# EAGLE design bridgeScheme (EAGLE 8.0.2)
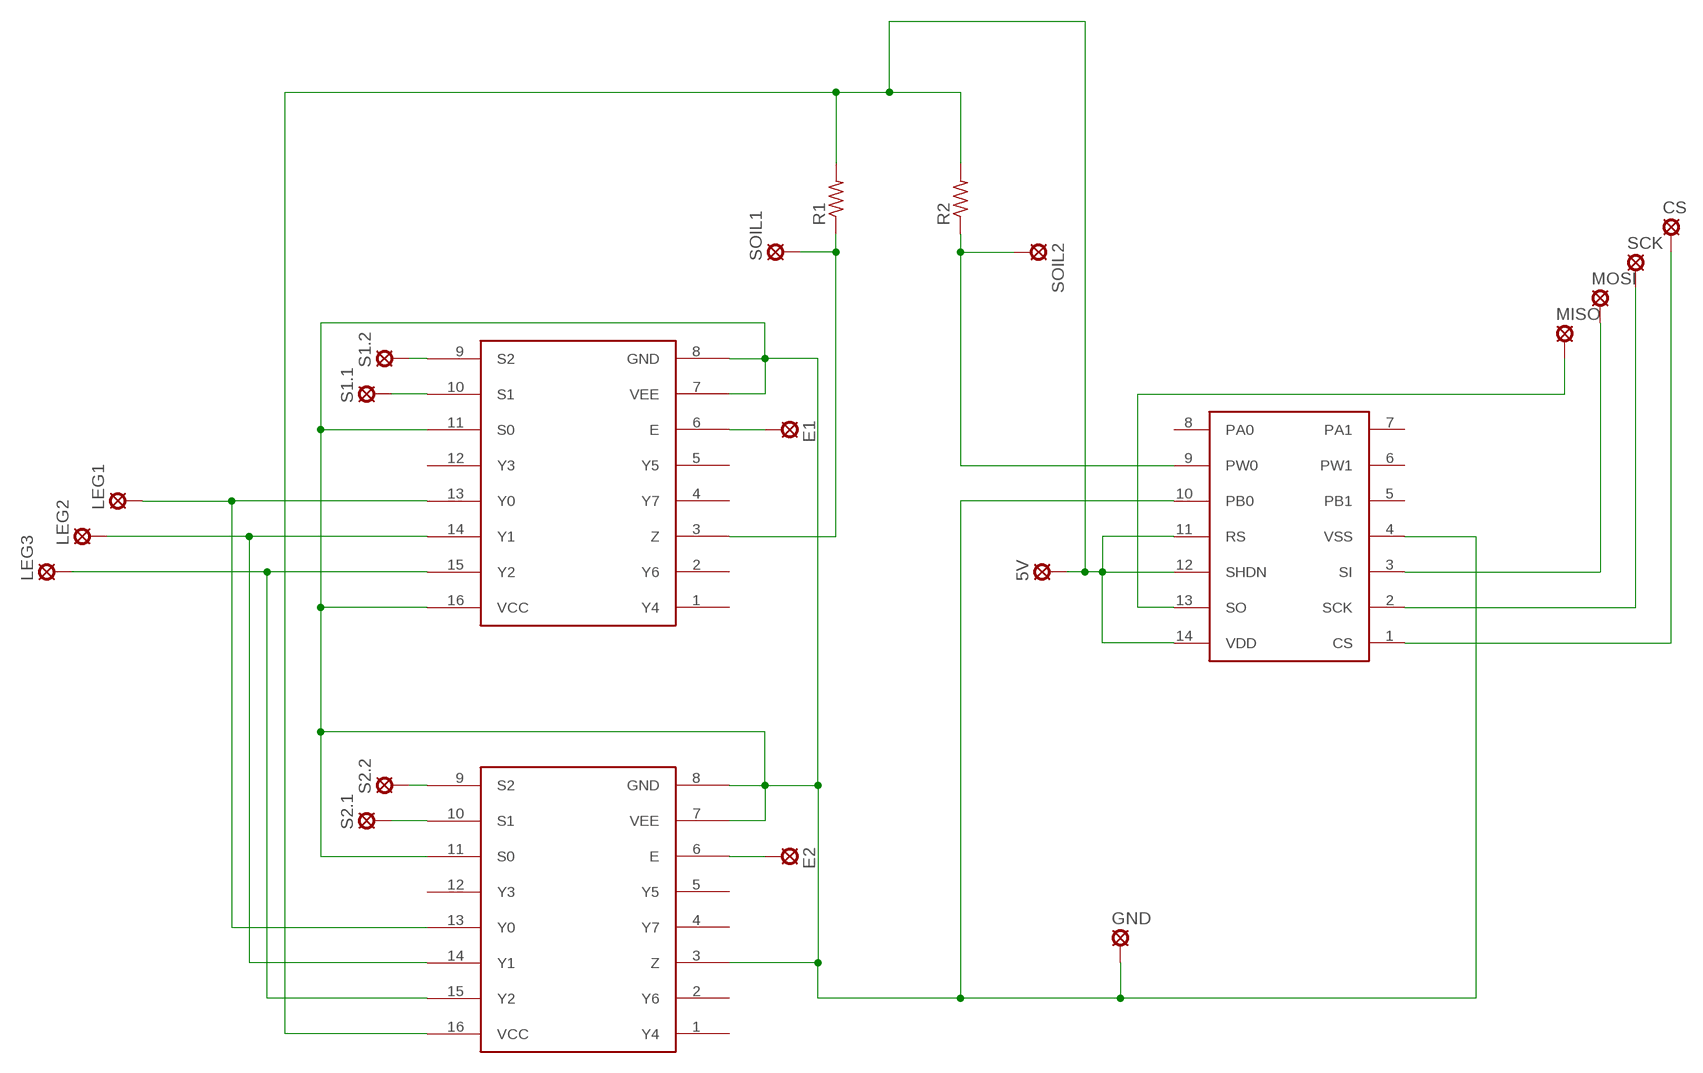
[diagram p0: schematic, sheet 1]

## Parts
5V  LSP10  [LSP10]
CS  LSP10  [LSP10]
E1  LSP10  [LSP10]
E2  LSP10  [LSP10]
GND  LSP10  [LSP10]
LEG1  LSP10  [LSP10]
LEG2  LSP10  [LSP10]
LEG3  LSP10  [LSP10]
MISO  LSP10  [LSP10]
MOSI  LSP10  [LSP10]
R1  R-US_0207/10  [0207/10]
R2  R-US_0207/10  [0207/10]
S1.1  LSP10  [LSP10]
S1.2  LSP10  [LSP10]
S2.1  LSP10  [LSP10]
S2.2  LSP10  [LSP10]
SCK  LSP10  [LSP10]
SOIL1  LSP10  [LSP10]
SOIL2  LSP10  [LSP10]
U$1  MCP42100!  [DIL14]
U$2  74HC4051!  [DIL16]
U$3  74HC4051!  [DIL16]

## Nets
5V: 5V.MP R1.2 R2.2 U$1.11(RS) U$1.12(SHDN) U$1.14(VDD) U$3.16(VCC)
CS: CS.MP U$1.1(CS)
E1: E1.MP U$2.6(E)
E2: E2.MP U$3.6(E)
GND: GND.MP U$1.4(VSS) U$1.10(PB0) U$2.7(VEE) U$2.8(GND) U$2.11(S0) U$2.16(VCC) U$3.3(Z) U$3.7(VEE) U$3.8(GND) U$3.11(S0)
MISO: MISO.MP U$1.13(SO)
MOSI: MOSI.MP U$1.3(SI)
S1.1: S1.1.MP U$2.10(S1)
S1.2: S1.2.MP U$2.9(S2)
S2.1: S2.1.MP U$3.10(S1)
S2.2: S2.2.MP U$3.9(S2)
SCK: SCK.MP U$1.2(SCK)
SOIL-1: R1.1 SOIL1.MP U$2.3(Z)
SOIL-2: R2.1 SOIL2.MP U$1.9(PW0)
Y0: LEG1.MP U$2.13(Y0) U$3.13(Y0)
Y1: LEG2.MP U$2.14(Y1) U$3.14(Y1)
Y2: LEG3.MP U$2.15(Y2) U$3.15(Y2)
Unconnected: U$1.5(PB1) U$1.6(PW1) U$1.7(PA1) U$1.8(PA0) U$2.1(Y4) U$2.2(Y6) U$2.4(Y7) U$2.5(Y5) U$2.12(Y3) U$3.1(Y4) U$3.2(Y6) U$3.4(Y7) U$3.5(Y5) U$3.12(Y3)

## Library data of the parts
5V CS E1 E2 GND LEG1-LEG3 MISO MOSI S1.1 S1.2 S2.1 S2.2 SCK SOIL1 SOIL2 = solpad:LSP10: SOLDER PAD drill 1.0 mm, distributor Buerklin, 12H555
R1 R2 = rcl:R-US_: RESISTOR, American symbol
U$1 = elements_cs2016:MCP42100!
U$2 U$3 = elements_cs2016:74HC4051!

## Board
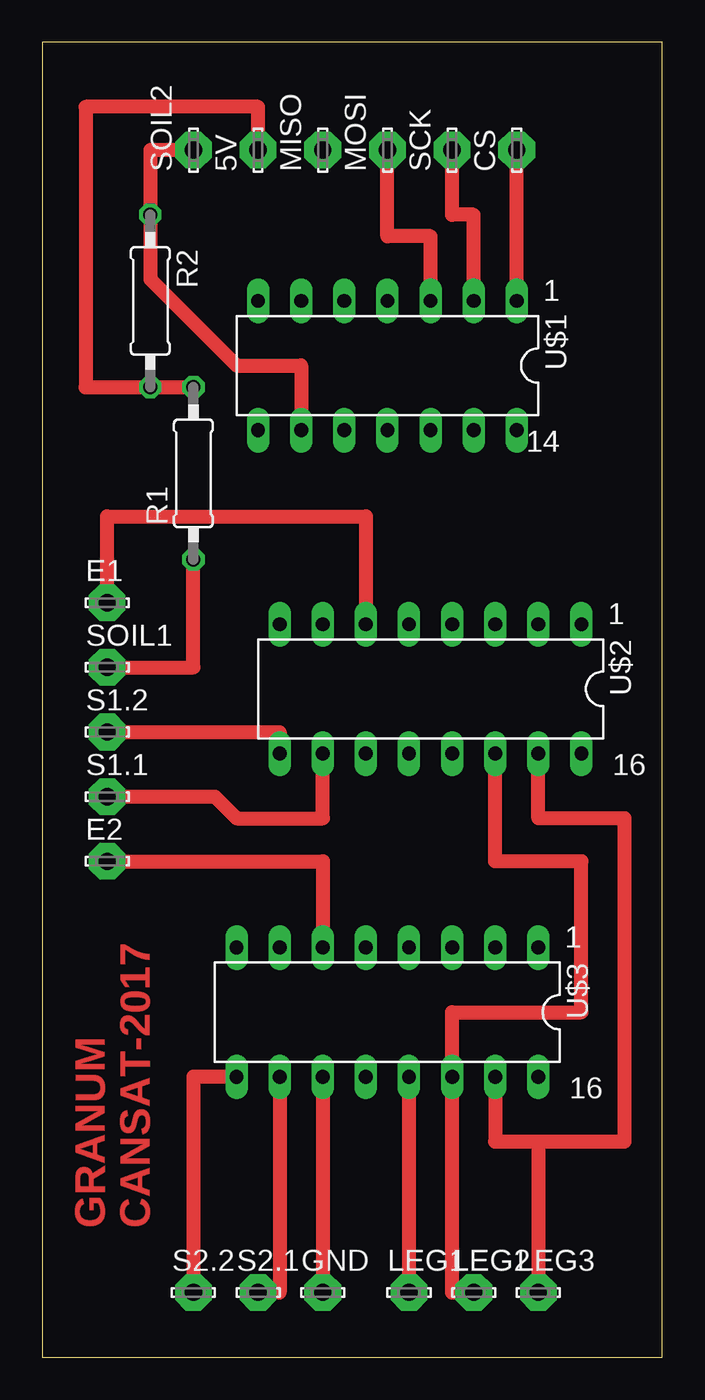
[diagram p1: board, top side]
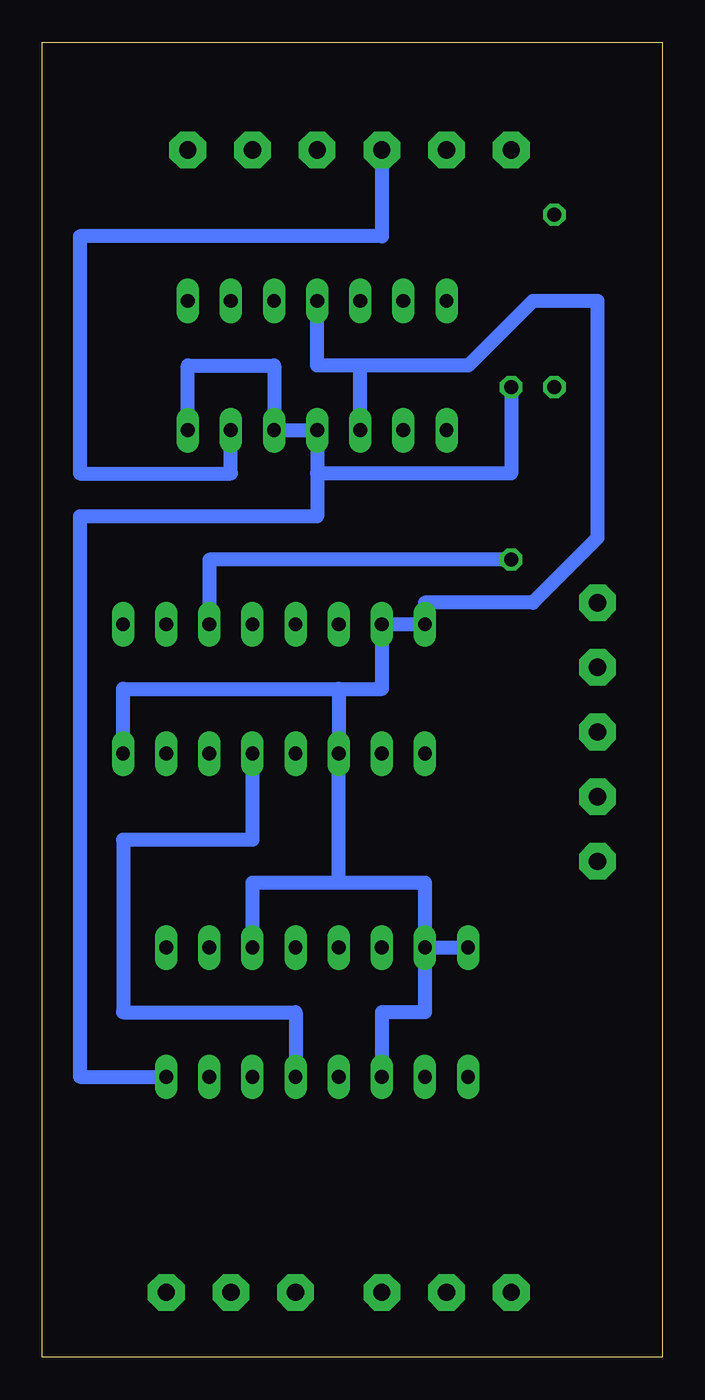
[diagram p2: board, bottom side, seen from below]

Size 36.5 x 77.46 mm. Coordinates in mm from the lower left corner, seen from the top.
Outline: 0,0 36.5,0 36.5,77.46 0,77.46 0,0
Copper layers (1*16): Top 0.035mm / dielectric 1.5mm / Bottom 0.035mm
Design rules "default": minimum track width 10mil, minimum drill 24mil, track to track 8mil, track to pad 8mil, pad to pad 8mil, via to via 8mil, smd to smd 8mil, copper to edge 40mil, drill to drill 8mil, minimum pad ring 10mil, minimum via ring 8mil, stop-mask expansion 4mil, vias tented up to drill 0mil, thermal gap 10mil

### Footprints (pad centres in the part's own frame; a part is rotated, then mirrored left to right if it is on the bottom)
LSP10 = drill 1.016 pad 2.159 octagon: MP 0,0
0207/10 = drill 0.813 octagon: 1 -5.08,0; 2 5.08,0
DIL14 = drill 0.813 long: 1 -7.62,-3.81; 2 -5.08,-3.81; 3 -2.54,-3.81; 4 0,-3.81; 5 2.54,-3.81; 6 5.08,-3.81; 7 7.62,-3.81; 8 7.62,3.81; 9 5.08,3.81; 10 2.54,3.81; 11 0,3.81; 12 -2.54,3.81; 13 -5.08,3.81; 14 -7.62,3.81
DIL16 = drill 0.813 long: 1 -8.89,-3.81; 2 -6.35,-3.81; 3 -3.81,-3.81; 4 -1.27,-3.81; 5 1.27,-3.81; 6 3.81,-3.81; 7 6.35,-3.81; 8 8.89,-3.81; 9 8.89,3.81; 10 6.35,3.81; 11 3.81,3.81; 12 1.27,3.81; 13 -1.27,3.81; 14 -3.81,3.81; 15 -6.35,3.81; 16 -8.89,3.81

### Placement (x,y rotation side)
5V  12.7,71.12 90 top
CS  27.94,71.12 90 top
E1  3.81,44.45 0 top
E2  3.81,29.21 0 top
GND  16.51,3.81 0 top
LEG1  21.59,3.81 0 top
LEG2  25.4,3.81 0 top
LEG3  29.21,3.81 0 top
MISO  16.51,71.12 90 top
MOSI  20.32,71.12 90 top
R1  8.89,52.07 90 top
R2  6.35,62.23 270 top
S1.1  3.81,33.02 0 top
S1.2  3.81,36.83 0 top
S2.1  12.7,3.81 0 top
S2.2  8.89,3.81 0 top
SCK  24.13,71.12 90 top
SOIL1  3.81,40.64 0 top
SOIL2  8.89,71.12 90 top
U$1  20.32,58.42 180 top
U$2  22.86,39.37 180 top
U$3  20.32,20.32 180 top

### Tracks (layer width: path | path; a pad name or v marks a point on that pad's centre or on a via)
5V
  Top 0.813: R1.2 R2.2 2.54,57.15 2.54,73.66 12.7,73.66 5V.MP
  Bottom 0.813: U$1.14 27.94,58.42 22.86,58.42 U$1.12 U$1.11 20.32,52.07 | R1.2 8.89,52.07 20.32,52.07 | 20.32,52.07 20.32,49.53 34.29,49.53 34.29,16.51 U$3.16
CS
  Top 0.813: U$1.1 CS.MP
E1
  Top 0.813: E1.MP 3.81,49.53 19.05,49.53 U$2.6
E2
  Top 0.813: E2.MP 16.51,29.21 U$3.6
GND
  Top 0.813: U$3.11 GND.MP
  Bottom 0.813: U$3.7 U$3.8 | 19.05,27.94 U$2.11 19.05,39.37 | U$3.7 13.97,27.94 19.05,27.94 | 19.05,39.37 16.51,39.37 U$2.7 U$2.8 13.97,44.45 7.62,44.45 3.81,48.26 3.81,62.23 7.62,62.23 11.43,58.42 17.78,58.42 | U$1.10 17.78,58.42 | 17.78,58.42 20.32,58.42 U$1.4 | U$3.7 13.97,20.32 16.51,20.32 U$3.11 | U$3.3 24.13,27.94 19.05,27.94 | U$2.16 31.75,39.37 19.05,39.37
MISO
  Bottom 0.813: MISO.MP 16.51,66.04 34.29,66.04 34.29,52.07 25.4,52.07 U$1.13
MOSI
  Top 0.813: MOSI.MP 20.32,66.04 22.86,66.04 U$1.3
S1.1
  Top 0.813: U$2.10 16.51,31.75 11.43,31.75 10.16,33.02 S1.1.MP
S1.2
  Top 0.813: S1.2.MP 13.97,36.83 U$2.9
S2.1
  Top 0.813: U$3.10 13.97,3.81 S2.1.MP
S2.2
  Top 0.813: U$3.9 8.89,16.51 S2.2.MP
SCK
  Top 0.813: U$1.2 25.4,67.31 24.13,67.31 SCK.MP
SOIL-1
  Top 0.813: SOIL1.MP 8.89,40.64 R1.1
  Bottom 0.813: R1.1 26.67,46.99 U$2.3
SOIL-2
  Top 0.813: SOIL2.MP 6.35,71.12 R2.1 6.35,63.5 11.43,58.42 15.24,58.42 U$1.9
Y0
  Top 0.813: U$3.13 LEG1.MP
  Bottom 0.813: U$3.13 21.59,20.32 31.75,20.32 31.75,30.48 24.13,30.48 U$2.13
Y1
  Top 0.813: LEG2.MP 24.13,3.81 U$3.14 24.13,20.32 31.75,20.32 31.75,29.21 26.67,29.21 U$2.14
Y2
  Top 0.813: U$2.15 29.21,31.75 34.29,31.75 34.29,12.7 29.21,12.7 | 29.21,12.7 LEG3.MP | U$3.15 26.67,12.7 29.21,12.7

### Text on the board
Top: GRANUM / CANSAT-2017